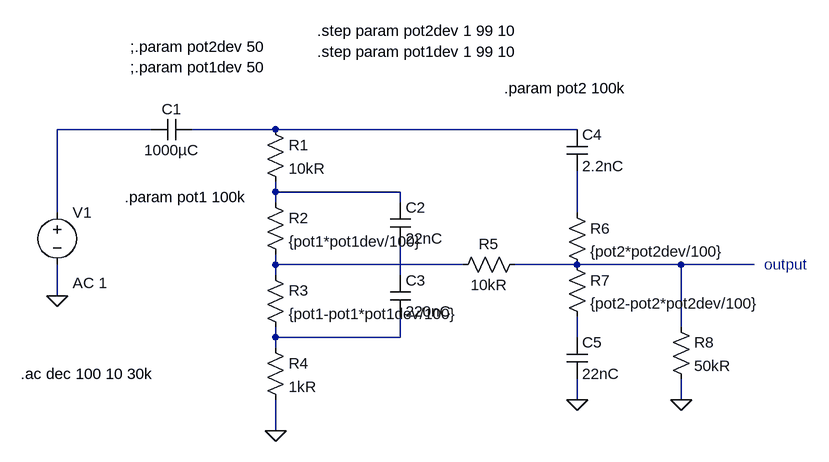
[diagram p0: schematic Draft7 baxandall tone control circuit.asc]
Draft7 baxandall tone control circuit.asc, the LTspice schematic file:
Version 4.1
SHEET 1 1136 680
WIRE 112 64 -32 64
WIRE 304 64 176 64
WIRE 768 64 304 64
WIRE 304 160 304 144
WIRE 496 160 304 160
WIRE 304 176 304 160
WIRE 496 176 496 160
WIRE -32 192 -32 64
WIRE 768 192 768 128
WIRE 304 272 304 256
WIRE 592 272 304 272
WIRE 768 272 672 272
WIRE 928 272 768 272
WIRE 1040 272 928 272
WIRE 304 288 304 272
WIRE 496 288 496 240
WIRE -32 320 -32 272
WIRE 928 368 928 272
WIRE 304 384 304 368
WIRE 496 384 496 352
WIRE 496 384 304 384
WIRE 768 384 768 352
WIRE 304 400 304 384
WIRE 768 480 768 448
WIRE 928 480 928 448
WIRE 304 528 304 480
FLAG 928 480 0
FLAG 768 480 0
FLAG 304 528 0
FLAG -32 320 0
SYMBOL voltage -32 176 R0
WINDOW 123 24 124 Left 2
WINDOW 39 0 0 Left 0
SYMATTR InstName V1
SYMATTR Value ""
SYMATTR Value2 AC 1
SYMBOL cap 176 48 R90
WINDOW 0 0 32 VBottom 2
WINDOW 3 32 32 VTop 2
SYMATTR InstName C1
SYMATTR Value 1000µC
SYMBOL res 288 48 R0
SYMATTR InstName R1
SYMATTR Value 10kR
SYMBOL res 288 160 R0
SYMATTR InstName R2
SYMATTR Value {pot1*pot1dev/100}
SYMBOL res 288 272 R0
SYMATTR InstName R3
SYMATTR Value {pot1-pot1*pot1dev/100}
SYMBOL res 288 384 R0
SYMATTR InstName R4
SYMATTR Value 1kR
SYMBOL cap 480 176 R0
SYMATTR InstName C2
SYMATTR Value 22nC
SYMBOL cap 480 288 R0
SYMATTR InstName C3
SYMATTR Value 220nC
SYMBOL res 688 256 R90
WINDOW 0 0 56 VBottom 2
WINDOW 3 32 56 VTop 2
SYMATTR InstName R5
SYMATTR Value 10kR
SYMBOL cap 752 64 R0
SYMATTR InstName C4
SYMATTR Value 2.2nC
SYMBOL res 752 176 R0
SYMATTR InstName R6
SYMATTR Value {pot2*pot2dev/100}
SYMBOL res 752 256 R0
SYMATTR InstName R7
SYMATTR Value {pot2-pot2*pot2dev/100}
SYMBOL cap 752 384 R0
SYMATTR InstName C5
SYMATTR Value 22nC
SYMBOL res 912 352 R0
SYMATTR InstName R8
SYMATTR Value 50kR
TEXT 1056 272 Left 2 ;output
TEXT 72 168 Left 2 !.param pot1 100k
TEXT 656 0 Left 2 !.param pot2 100k
TEXT 80 -32 Left 2 !;.param pot1dev 50
TEXT 80 -64 Left 2 !;.param pot2dev 50
TEXT -88 440 Left 2 !.ac dec 100 10 30k
TEXT 368 -88 Left 2 !.step param pot2dev 1 99 10
TEXT 368 -56 Left 2 !.step param pot1dev 1 99 10

The netlist it stands for:
* Draft7 baxandall tone control circuit.asc
V1 N001 0 AC 1
C1 N002 N001 1000µC
R1 N002 N003 10kR
R2 N003 N005 {pot1*pot1dev/100}
R3 N005 N008 {pot1-pot1*pot1dev/100}
R4 N008 0 1kR
C2 N003 N007 22nC
C3 N007 N008 220nC
R5 N006 N005 10kR
C4 N002 N004 2.2nC
R6 N004 N006 {pot2*pot2dev/100}
R7 N006 N009 {pot2-pot2*pot2dev/100}
C5 N009 0 22nC
R8 N006 0 50kR
* output
.param pot1 100k
.param pot2 100k
;.param pot1dev 50
;.param pot2dev 50
.ac dec 100 10 30k
.step param pot2dev 1 99 10
.step param pot1dev 1 99 10
.backanno
.end